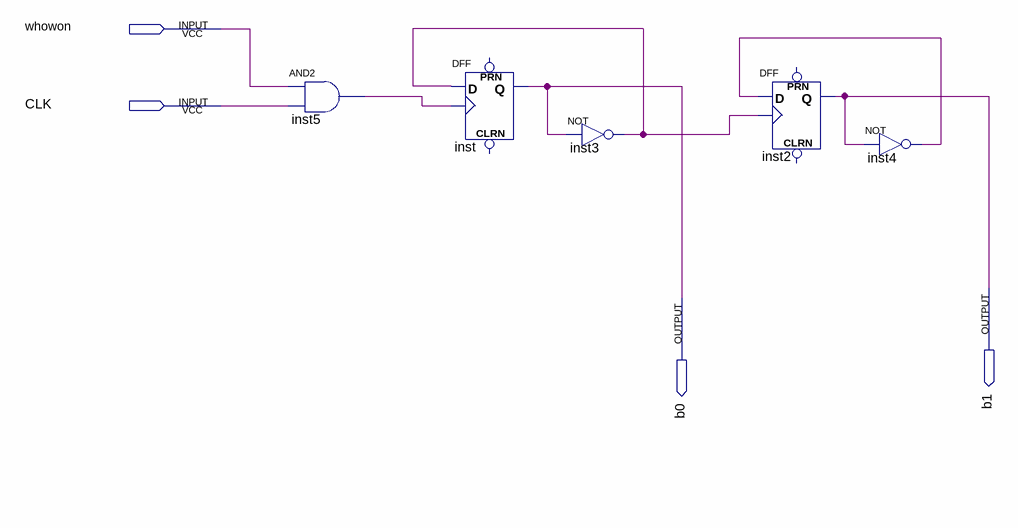
[diagram p0: schematic sheet]
// Quartus schematic counter.bdf as structural Verilog: 5 symbols, 4 pins
module counter (
  input  whowon,
  input  CLK,
  output b1,
  output b0
);

  wire inst3_out, inst4_out, inst5_out;

  and inst5 (inst5_out, whowon, CLK);
  DFF inst (.CLK(inst5_out), .D(inst3_out), .Q(b0));  // open: CLRN, PRN
  not inst3 (inst3_out, b0);
  DFF inst2 (.CLK(inst3_out), .D(inst4_out), .Q(b1));  // open: CLRN, PRN
  not inst4 (inst4_out, b1);
endmodule
